# Altium project AM3358_DEV_BOARD.PrjPcb (part 3 of 3)

## Sheet 11. USB.SchDoc
size A3
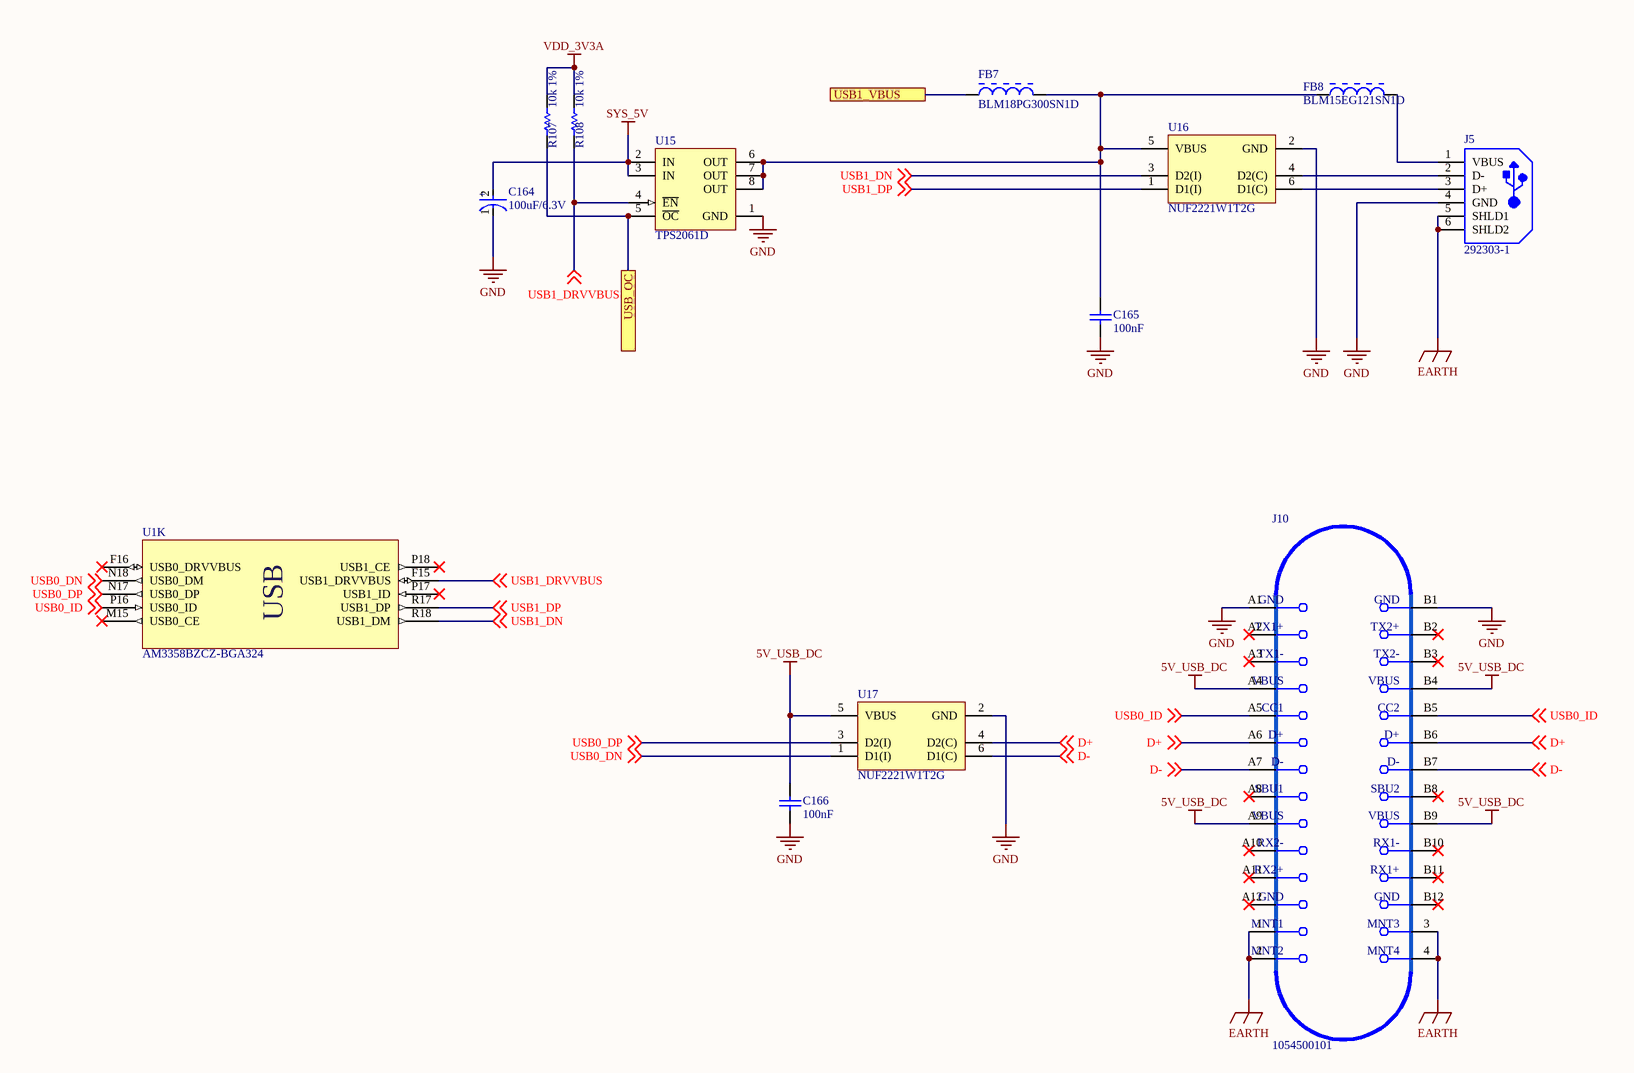
[diagram p8: 11. USB.SchDoc]

### Parts
C164  100uF/6.3V  [FP-NLJB-MFG]
C165  100nF  [CAPC1005X55X25LL05T10]
C166  100nF  [CAPC1005X55X25LL05T10]
FB7  BLM18PG300SN1D  [MURA-BLM18PG_KG-CHIP-2_V1]
FB8  BLM15EG121SN1D  [MURA-BLM15-CHIP-2_V]
J5  292303-1  [TE-292303-1_V]
J10  1054500101  [FP-1054500101-MFG]
R107  10k 1%  [RESC1005X40X25LL05T05]
R108  10k 1%  [RESC1005X40X25LL05T05]
U1  AM3358BZCZ-BGA324  [TI-ZCZ324]  (part K of 11)
U15  TPS2061D  [D0008A_N]
U16  NUF2221W1T2G  [ONSC-SC70-6-419B-02_W_V]
U17  NUF2221W1T2G  [ONSC-SC70-6-419B-02_W_V]

### Ports
USB1_VBUS, USB_OC

### Nets
5V_USB_DC: C166.2 J10.A4(VBUS) J10.A9(VBUS) J10.B4(VBUS) J10.B9(VBUS) U17.5(VBUS)
EARTH: J5.5(SHLD1) J5.6(SHLD2) J10.1(MNT_1) J10.2(MNT_2) J10.3(MNT_3) J10.4(MNT_4)
GND: C164.1(C) C165.1 C166.1 J5.4(GND) J10.A1(GND) J10.B1(GND) U15.1(GND) U16.2(GND) U17.2(GND)
SYS_5V: C164.2(A) U15.2(IN) U15.3(IN)
VDD_3V3A: R107.2 R108.2
D+: J10.A6(D+) J10.B6(D+) U17.4(D2(C)) ; off-sheet D+
D-: J10.A7(D-) J10.B7(D-) U17.6(D1(C)) ; off-sheet D-
USB0_DN: U1.N18(USB0_DM) U17.1(D1(I)) ; off-sheet USB0_DN
USB0_DP: U1.N17(USB0_DP) U17.3(D2(I)) ; off-sheet USB0_DP
USB0_ID: J10.A5(CC1) J10.B5(CC2) U1.P16(USB0_ID) ; off-sheet USB0_ID
USB1_DN: U1.R18(USB1_DM) U16.3(D2(I)) ; off-sheet USB1_DN
USB1_DP: U1.R17(USB1_DP) U16.1(D1(I)) ; off-sheet USB1_DP
USB1_DRVVBUS: R108.1 U1.F15(USB1_DRVVBUS) U15.4(~{EN}) ; off-sheet USB1_DRVVBUS
NetC165_2: C165.2 FB7.2 FB8.1 U15.6(OUT) U15.7(OUT) U15.8(OUT) U16.5(VBUS)
NetFB7_1: FB7.1 ; port USB1_VBUS
NetFB8_2: FB8.2 J5.1(VBUS)
NetJ5_2: J5.2(D-) U16.4(D2(C))
NetJ5_3: J5.3(D+) U16.6(D1(C))
NetR107_1: R107.1 U15.5(~{OC}) ; port USB_OC

Not connected (* = marked no-connect by the designer): J10 A2(TX1+)* A3(TX1-)* A8(SBU1)* A10(RX2-)* A11(RX2+)* A12(GND)* B2(TX2+)* B3(TX2-)* B8(SBU2)* B10(RX1-)* B11(RX1+)* B12(GND)*; U1 F16(USB0_DRVVBUS)* M15(USB0_CE)* P17(USB1_ID)* P18(USB1_CE)*

### Notes on the sheet
- Title
- Size:
- Date:
- A4
- Number:
- Time:
- Revision:
- Sheet
- of
- N.S.T
- Design by:
- Check by:
- https://github.com/tung080827
- (in symbol AM3358BZCZ100, part K) USB
- (in symbol CMP-04425-000004-1) +
- (in symbol USB-C) MNT1; MNT3; MNT2; MNT4

### Library data of the parts
C164 = CMP-04425-000004-1: CAP NIOB OXI 100UF 20% 6.3V 1210; Manufacturer: AVX Corporation; Manufacturer Part Number: NLJB107M006R1700; Leakage Current: 60uA; Life: 1000Hours; Ripple Current: 245mA; Material: Niobium Oxide; Esr: 1700mΩ; Temperature Coefficient: +25/-20%; Height: 2.1mm; Voltage Rating: 6.3V; Package: NLJB; Digikey Description: CAP NIOB OXI 100UF 20% 6.3V 1210; ComponentLink2Description: Datasheet; RoHS: TRUE; Mouser Description: Niobium Oxide Capacitors 6.3volts 100uF 20% ESR=1700mOhms; Footprint Url: https://www.avx.com/download/software/literature/AVX-Footprint-Library.pdf; Capacitance: 100uF; Temperature Range High: +105°C; Temperature: -55°C to +105°C; Temperature Range Low: -55°C; Device Class L3: Niobium Oxide; ComponentLink2URL: http://datasheets.avx.com/NLJ.pdf; Device Class L1: Passive Components; Automotive: No; Value: 100uF; Tolerance: 20%; Lead Free: Yes; Category: Cap; Device Class L2: Capacitors; Octopart: https://octopart.com/nljb107m006r1700-avx-10566967
C165 C166 = CMP-2100-03641-1: Chip Capacitor, 0.1 uF, +/- 10%, 16 V, -55 to 125 degC, 0402 (1005 Metric), RoHS, Tape and Reel; Manufacturer: Murata; Material: Ceramic; Insulation Resistance: 10GR; Voltage: 16V; Dielectric: X7R; REACH SVHC: NoSVHC; Depth: 0.5mm; Case/Package: 0402; Datasheet URL: http://psearch.en.murata.com/capacitor/product/GRM155R71C104KA88%23.pdf; Lead Free: LeadFree; Dielectric Material: Ceramic; Manufacturer URL: http://www.murata.com/; Min Operating Temperature: -55degC; Length: 1mm; Case Code (Metric): 1005; Radiation Hardening: No; Package Reference: 0402; RoHSCompliant: true; Datasheet Version: 42675.0; Thickness: 0.022inch; Packaging: TapeandReel; Voltage Rating (DC): 16V; Tolerance: 10%; Max Operating Temperature: 125degC; Package Description: 2-Pin Surface Mount Device, Body 1 x 0.5 mm; Mount: SurfaceMount; Height: 0.5mm; Width: 0.5mm; Number of Pins: 2; Voltage Rating: 16V; Case Code (Imperial): 0402; Termination: SMD/SMT; Capacitance: 100nF; Package Quantity: 1
FB7 = CMP-0686-00572-2: Chip Ferrite Bead for Power Lines, 30 Ohm, 1000 mA, -55 to 125 degC, 1.6 x 0.8 x 0.95 mm SMD, Tape and Reel; Manufacturer: Murata; DC Resistance: 0.05 Ohm Max.; Impedance (at 100 MHz): 30 Ohm Typ.; Rated Current: 1000 mA; ComponentLink1Description: Manufacturer URL; Packing: Tape and Reel; ComponentLink2URL: http://www.murata.com/products/catalog/pdf/c31e.pdf; DatasheetVersion: 08/2013; PartNumber: BLM18PG300SN1D; Mounting Technology: Surface Mount; ComponentLink2Description: Datasheet; PackageReference: BLM18_H950-2; Operating Temperature Range: -55 to 125 degC; ComponentLink3Description: Package Specification; PackageDescription: 2-Pin Chip, Body 1.6 x 0.8 mm; ComponentLink1URL: http://www.murata.com/; ComponentLink3URL: http://www.murata.com/products/catalog/pdf/c31e.pdf
FB8 = CMP-0686-00148-3: as FB9-FB11 on sheet 08. PMIC; ComponentLink3URL: http://www.murata.com/products/catalog/pdf/c31e.pdf; ComponentLink1URL: http://www.murata.com/; Packing: Tape and Reel; Operating Temperature Range: -55 to 125 degC; PackageReference: BLM15-2; ComponentLink2Description: Datasheet; PackageDescription: 2-Pin Chip, Body 1 x 0.5 mm; ComponentLink2URL: http://www.murata.com/products/catalog/pdf/c31e.pdf; Mounting Technology: Surface Mount; ComponentLink3Description: Package Specification; ComponentLink1Description: Manufacturer URL; PartNumber: BLM15EG121SN1D; DatasheetVersion: 08/2013
J5 = CMP-2000-05404-1: 1 Port Right Angle Through Hole Mount Female Type A USB Connector, 4 Position, -55 to 85 degC, RoHS, Tube; Manufacturer: TE Connectivity; Contact Termination Type: Solder; No. of Contacts: 4; Connector Mounting: PCB; SVHC: NoSVHC(16-Jun-2014); Gender: Receptacle; Connector Type: USBA; Package Description: 4-Pin Through Hole Device, Body 14 x 13.13 mm, Pitch 2.5 mm; Contact Plating: Gold; Package Reference: 292303-1; Contact Material: Copper; Datasheet URL: http://www.farnell.com/cad/1653030.pdf; Datasheet Version: Feb-12; Manufacturer URL: http://www.te.com/
J10 = USB-C: CONN RCP USB3.1 TYPEC 24P SMD RA; Manufacturer: Molex; Number Of Contacts: 24; Voltage Rating: 30V; Shielding: true; Is Female: yes; Current Rating: 0.25/1.25/5A; Pitch: 0.5mm; Conn Orientation: Right Angle; Package: 0; Height: 3.44mm; Footprint Url: https://www.molex.com/pdm_docs/sd/1054500101_sd.pdf; Device Class L1: Connectors; Category: Conn; Device Class L2: USB Connectors; Digikey Description: CONN RCP USB3.1 TYPEC 24P SMD RA; Contact Material: Gold,Nickel; Mouser Description: USB Shielded I/O Receptacle; Type C; Right Angle; Surface Mount; Gold over Nickel; ComponentLink2Description: Datasheet; Lead Free: Yes; Automotive: No; Temperature Range High: +85°C; RoHS: TRUE; Octopart: https://octopart.com/105450-0101-molex-68082325; ComponentLink2URL: https://www.molex.com/webdocs/datasheets/pdf/en-us/1054500101_IO_CONNECTORS.pdf; Temperature: -30°C to +85°C; Usb Standard: USB 3.1; Temperature Range Low: -30°C; Device Class L3: unset; Manufacturer Part Number: 1054500101
R107 R108 = CMP-2002-08135-1: as R54-R64 on sheet 10. eMMC
U1 = AM3358BZCZ100: Sitara ARM Cortex-A8 32-Bit RISC Microprocessor, 1 GHz, SGX530 3D Graphics Engine, Programmable Real-Time Unit and Industrial Communication Subsystem (PRU-ICSS), 0 to 90 degC, 324-pin NFBGA (ZCZ), Green (RoHS & no Sb/Br); Supplier 1: Digi-Key
U15 = CMP-0337-00164-2: Single 1 A Current-Limited, Power-Distribution Switch, 1.5 A Current Limit, -40 to 85 degC, 8-pin SOIC (D), Green (RoHS & no Sb/Br); Manufacturer: Texas Instruments; NEMKO: TRUE; Continuous Current(Max)(A): 1; rDS(on) per FET(Typ)(mOhms): 70; Current Limit(A): 1.5; Enable: Active Low; Vin(Min)(V): 2.7; Vin(Max)(V): 5.5; Rating: Catalog; UL Listed: TRUE; PackageReference: D0008A; Code_JEDEC: MS-012AA; Eco-Plan: Green (RoHS & no Sb/Br); PackageDescription: 8-Pin Plastic Small Outline Integrated Circuit, 4.9 x 3.9 mm, Pitch 1.27 mm Pitch; PartNumber: TPS2061D; ComponentLink1Description: Datasheet; Mounting Technology: Surface Mount; ComponentLink1URL: http://www.ti.com/general/docs/lit/getliterature.tsp?genericPartNumber=TPS2061&fileType=pdf; DatasheetVersion: SLVS490I; Number of Switches: 1; PackageVersion: revM, Jun-2011
U16 U17 = CMP-1066-00023-1: USB Upstream Terminator with ESD Protection, -55 to 125 degC, 6-Pin SC70, Pb-Free, Tape and Reel; Manufacturer: On Semiconductor; C Typ (pF): 42; Number of Lines: 3; V(BR) Typ (V): 6.8; VRWM Max (V): 5.25; RoHS: Pb-Free; ComponentLink1Description: Manufacturer URL; ComponentLink3Description: Package Specification; ComponentLink2URL: http://www.onsemi.cn/pub_link/Collateral/NUF2221W1T2-D.PDF; PackageDescription: 6-Pin Small Outline Transistor, Body 2 x 1.25 mm, Pitch 0.65 mm; DatasheetVersion: Rev. 0; PartNumber: NUF2221W1T2G; ComponentLink2Description: Datasheet; PackageVersion: Rev. W; Mounting Technology: Surface Mount; ComponentLink1URL: http://www.onsemi.com/; Packing: Tape and Reel; PackageReference: SC70-6-419B-02_W; ComponentLink3URL: http://www.onsemi.com/pub_link/Collateral/SMF05C-D.PDF

## Sheet 12. uSD.SchDoc
size A4
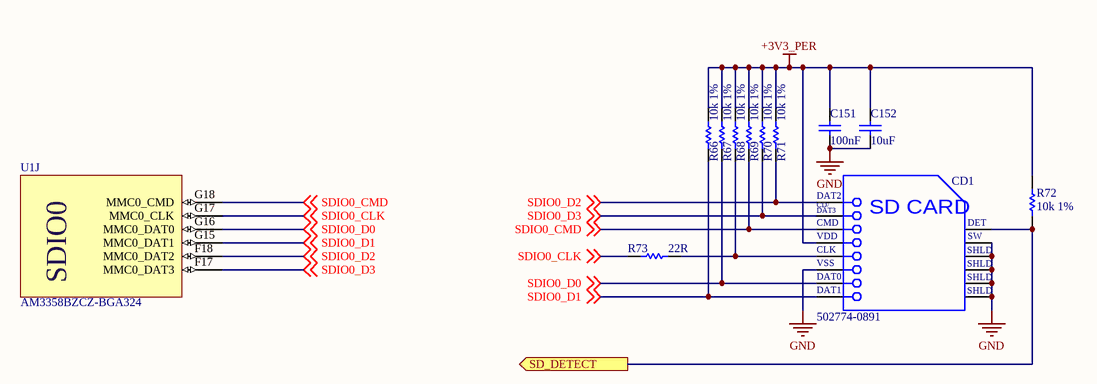
[diagram p9: 12. uSD.SchDoc]

### Parts
C151  100nF  [CAPC1005X55X25LL05T10]
C152  10uF  [CAPC1608X90X35NL10T15]
CD1  502774-0891  [MOLX-502774-0891_V]
R66  10k 1%  [RESC1005X40X25LL05T05]
R67  10k 1%  [RESC1005X40X25LL05T05]
R68  10k 1%  [RESC1005X40X25LL05T05]
R69  10k 1%  [RESC1005X40X25LL05T05]
R70  10k 1%  [RESC1005X40X25LL05T05]
R71  10k 1%  [RESC1005X40X25LL05T05]
R72  10k 1%  [RESC1005X40X25LL05T05]
R73  22R  [RESC1005X40X25LL05T05]
U1  AM3358BZCZ-BGA324  [TI-ZCZ324]  (part J of 11)

### Ports
SD_DETECT (out)

### Nets
+3V3_PER: C151.2 C152.2 CD1.4(VDD) R66.2 R67.2 R68.2 R69.2 R70.2 R71.2 R72.2
GND: C151.1 C152.1 CD1.6(VSS) CD1.10(SWITCH) CD1.11(SHLD) CD1.12(SHLD) CD1.13(SHLD) CD1.14(SHLD)
JTAG_EMU4: CD1.9(DETECT) R72.1 ; port SD_DETECT
SDIO0_CLK: R73.1 U1.G17(MMC0_CLK) ; off-sheet SDIO0_CLK
SDIO0_CMD: CD1.3(CMD) R69.1 U1.G18(MMC0_CMD) ; off-sheet SDIO0_CMD
SDIO0_D0: CD1.7(DAT0) R67.1 U1.G16(MMC0_DAT0) ; off-sheet SDIO0_D0
SDIO0_D1: CD1.8(DAT1) R66.1 U1.G15(MMC0_DAT1) ; off-sheet SDIO0_D1
SDIO0_D2: CD1.1(DAT2) R71.1 U1.F18(MMC0_DAT2) ; off-sheet SDIO0_D2
SDIO0_D3: CD1.2(CD/DAT3) R70.1 U1.F17(MMC0_DAT3) ; off-sheet SDIO0_D3
NetCD1_5: CD1.5(CLK) R68.1 R73.2

### Notes on the sheet
- Title
- Size:
- Date:
- A4
- Number:
- Time:
- Revision:
- Sheet
- of
- N.S.T
- Design by:
- Check by:
- https://github.com/tung080827
- (in symbol AM3358BZCZ100, part J) SDIO0
- (in symbol CMP-2000-05248-1) CD/; DAT3; SD CARD; DET; SW

### Library data of the parts
C151 = CMP-2100-03641-1: as C165 on sheet 11. USB; REACH SVHC: NoSVHC; Depth: 0.5mm; Case/Package: 0402; Datasheet URL: http://psearch.en.murata.com/capacitor/product/GRM155R71C104KA88%23.pdf; Lead Free: LeadFree; Dielectric Material: Ceramic; Manufacturer URL: http://www.murata.com/; Min Operating Temperature: -55degC; Length: 1mm; Case Code (Metric): 1005; Radiation Hardening: No; Package Reference: 0402; RoHSCompliant: true; Datasheet Version: 42675.0; Thickness: 0.022inch; Packaging: TapeandReel; Voltage Rating (DC): 16V; Tolerance: 10%; Max Operating Temperature: 125degC; Package Description: 2-Pin Surface Mount Device, Body 1 x 0.5 mm; Mount: SurfaceMount; Height: 0.5mm; Width: 0.5mm; Number of Pins: 2; Voltage Rating: 16V; Case Code (Imperial): 0402; Termination: SMD/SMT; Capacitance: 100nF; Package Quantity: 1
C152 = CMP-2006-02792-1: as C79-C81 on sheet 08. PMIC
CD1 = CMP-2000-05248-1: Micro SD Memory Card Connector, 0.5 A, 10 V (DC), -25 to 85 degC, 8-Pin SMT, RoHS, Tape and Reel; Manufacturer: Molex; 3D Model: 502774-0891.stp; Online Catalog: microSD™Series; Number of Positions: 10(8+2); Card Type: SecureDigital-microSD™; Insertion, Removal Method: PushIn,PushOut; Other Names: WM24066DKR; Connector Type: ConnectorandEjector; Features: Switch; Family: MemoryConnectors-PCCardSockets; Manufacturer URL: http://www.molex.com/; Mounting Type: SurfaceMount,RightAngle; Contact Finish Thickness: 20µin(0.51µm); Standard Package: 1; Series: 502774; Ejector Side: -; Datasheet Version: Rev. D, 04/2004; Category: Connectors,Interconnects; Contact Finish: Gold; Datasheet URL: https://datasheet.ciiva.com/1104/1499551-1104671.pdf; RoHS Information: 502774-0891CertofCompliance; Mounting Feature: Reverse-Bottom; Packaging: Digi-Reel; Height Above Board: 0.071"(1.80mm); Catalog Drawings: 502774-0891
R66-R72 = CMP-2002-08135-1: as R54-R64 on sheet 10. eMMC
R73 = CMP-1665-00027-3: Chip Resistor, 22 Ohm, +/- 1%, 0.1 W, -55 to 155 degC, 0402 (1005 Metric), RoHS, Tape and Reel; PartNumber: ERJ-2RKF22R0X; Case\/Package: 0402; Resistance: 22 Ohm; Power Rating: 100 mW; Voltage Rating: 50 V; ComponentLink2Description: Datasheet; Packaging: Tape and Reel; Weight: 2.8E-05oz; Pins: 2; Case Code (Imperial): 0402; Width: 0.5 mm; ComponentLink2URL: http://industrial.panasonic.com/cdbs/www-data/pdf/RDA0000/AOA0000C86.pdf; Height: 0.35 mm; PackageReference: 0402; REACH SVHC: Yes; Min Operating Temperature: -55 degC; Length: 1 mm; DatasheetVersion: 04/2015; RoHSCompliant: true; Package Quantity: 10000; Case Code (Metric): 1005; PackageDescription: 2-Pin Surface Mount Device, Body 1 x 0.5 mm; ComponentLink1URL: http://www.panasonic.com/; Mount: Surface Mount; Mounting Technology: Surface Mount; Tolerance: 1%; Max Operating Temperature: 155 degC; ComponentLink1Description: Manufacturer URL
U1 = AM3358BZCZ100: as U1 on sheet 11. USB; Supplier 1: Digi-Key

## Nets that join several sheets
5V_USB_DC: 08. PMIC (C71.2 U5.12), 11. USB (6 pins)
+1V8_WIFI: 07. WIFI (6 pins), 08. PMIC (C137.2 C138.2 U9.3)
+3V3_PER: 05. LCD (J6.4), 06. ETHERNET (7 pins), 07. WIFI (C86.2 FB5.1 U6.2 U7.2), 09. SDIO, PERIPHERAL (13 pins), 08. PMIC (C135.2 C140.2 L8.2 R51.2), 10. eMMC (27 pins), 12. uSD (10 pins)
EARTH: 06. ETHERNET (J4.S1 J4.S2 R26.2), 09. SDIO, PERIPHERAL (J9.SH1 J9.SH2), 11. USB (6 pins)
GND: 03. POWER (121 pins), 04. DDRAM (43 pins), 05. LCD (14 pins), 06. ETHERNET (27 pins), 07. WIFI (84 pins), 09. SDIO, PERIPHERAL (23 pins), 08. PMIC (36 pins), 10. eMMC (18 pins), 11. USB (9 pins), 12. uSD (8 pins)
SYS_5V: 05. LCD (J6.2), 09. SDIO, PERIPHERAL (J7.1), 08. PMIC (19 pins), 11. USB (C164.2 U15.2 U15.3)
VDD_1V8: 03. POWER (11 pins), 08. PMIC (C134.2 FB12.1 U5.40)
VDD_3V3A: 03. POWER (47 pins), 09. SDIO, PERIPHERAL (C159.2 U12.5), 08. PMIC (C133.2 U5.43 U8.2 U9.6), 11. USB (R107.2 R108.2)
VDD_CORE: 03. POWER (36 pins), 08. PMIC (C79.2 L3.2 U5.29)
VDD_MPU: 03. POWER (12 pins), 08. PMIC (C80.2 L2.2 U5.24)
VDDS: 03. POWER (15 pins), 08. PMIC (FB11.2 FB12.2)
VDDS_DDR_1V35: 03. POWER (13 pins), 04. DDRAM (37 pins), 08. PMIC (C81.2 L1.2 U5.19)
VREF_DDR_0V675: 03. POWER (C109.2 U1.J4), 04. DDRAM (8 pins)
VRTC: 03. POWER (C108.2 R4.1 U1.D7), 08. PMIC (FB10.2)
BT_EN: 07. WIFI (U4.41), 09. SDIO, PERIPHERAL (U1.A14)
ETH_RST: 03. POWER (5 pins), 06. ETHERNET (U2.19)
GPIO1_28: 05. LCD (J6.31), 09. SDIO, PERIPHERAL (J7.22 U1.T6)
I2C0_SCL: 09. SDIO, PERIPHERAL (U1.C16), 08. PMIC (U5.28)
I2C0_SDA: 09. SDIO, PERIPHERAL (U1.C17), 08. PMIC (U5.27)
JTAG_EMU2: 03. POWER (U1.A15), 09. SDIO, PERIPHERAL (J8.17)
JTAG_EMU3: 03. POWER (U1.D14), 07. WIFI (U7.3), 09. SDIO, PERIPHERAL (J8.18)
JTAG_EMU4: 09. SDIO, PERIPHERAL (J8.19 U1.C15), 12. uSD (CD1.9 R72.1)
NetFB7_1: 03. POWER (U1.T18), 11. USB (FB7.1)
NetJ7_38: 03. POWER (U1.C18), 09. SDIO, PERIPHERAL (J7.38)
NetR4_2: 03. POWER (R4.2 U1.C5), 08. PMIC (U5.13)
NetR36_2: 06. ETHERNET (R36.2 U2.16), 09. SDIO, PERIPHERAL (U1.M17)
NetR62_1: 09. SDIO, PERIPHERAL (U12.4), 10. eMMC (R62.1 U10.K5)
NetR107_1: 09. SDIO, PERIPHERAL (U1.R7), 11. USB (R107.1 U15.5)
NetU1_B5: 03. POWER (U1.B5), 08. PMIC (U5.46)
NetU1_B12: 07. WIFI (U7.10), 09. SDIO, PERIPHERAL (U1.B12)
NetU1_B15: 03. POWER (U1.B15 U11.3), 08. PMIC (U5.26)
NetU1_B18: 03. POWER (U1.B18), 08. PMIC (U5.45)
NetU1_C6: 03. POWER (U1.C6), 08. PMIC (U5.9)
NetU1_C13: 07. WIFI (U6.20 U7.20), 09. SDIO, PERIPHERAL (U1.C13)
NetU1_M18: 06. ETHERNET (U2.17), 09. SDIO, PERIPHERAL (U1.M18)
WL_EN: 07. WIFI (U4.40), 09. SDIO, PERIPHERAL (U1.D13)